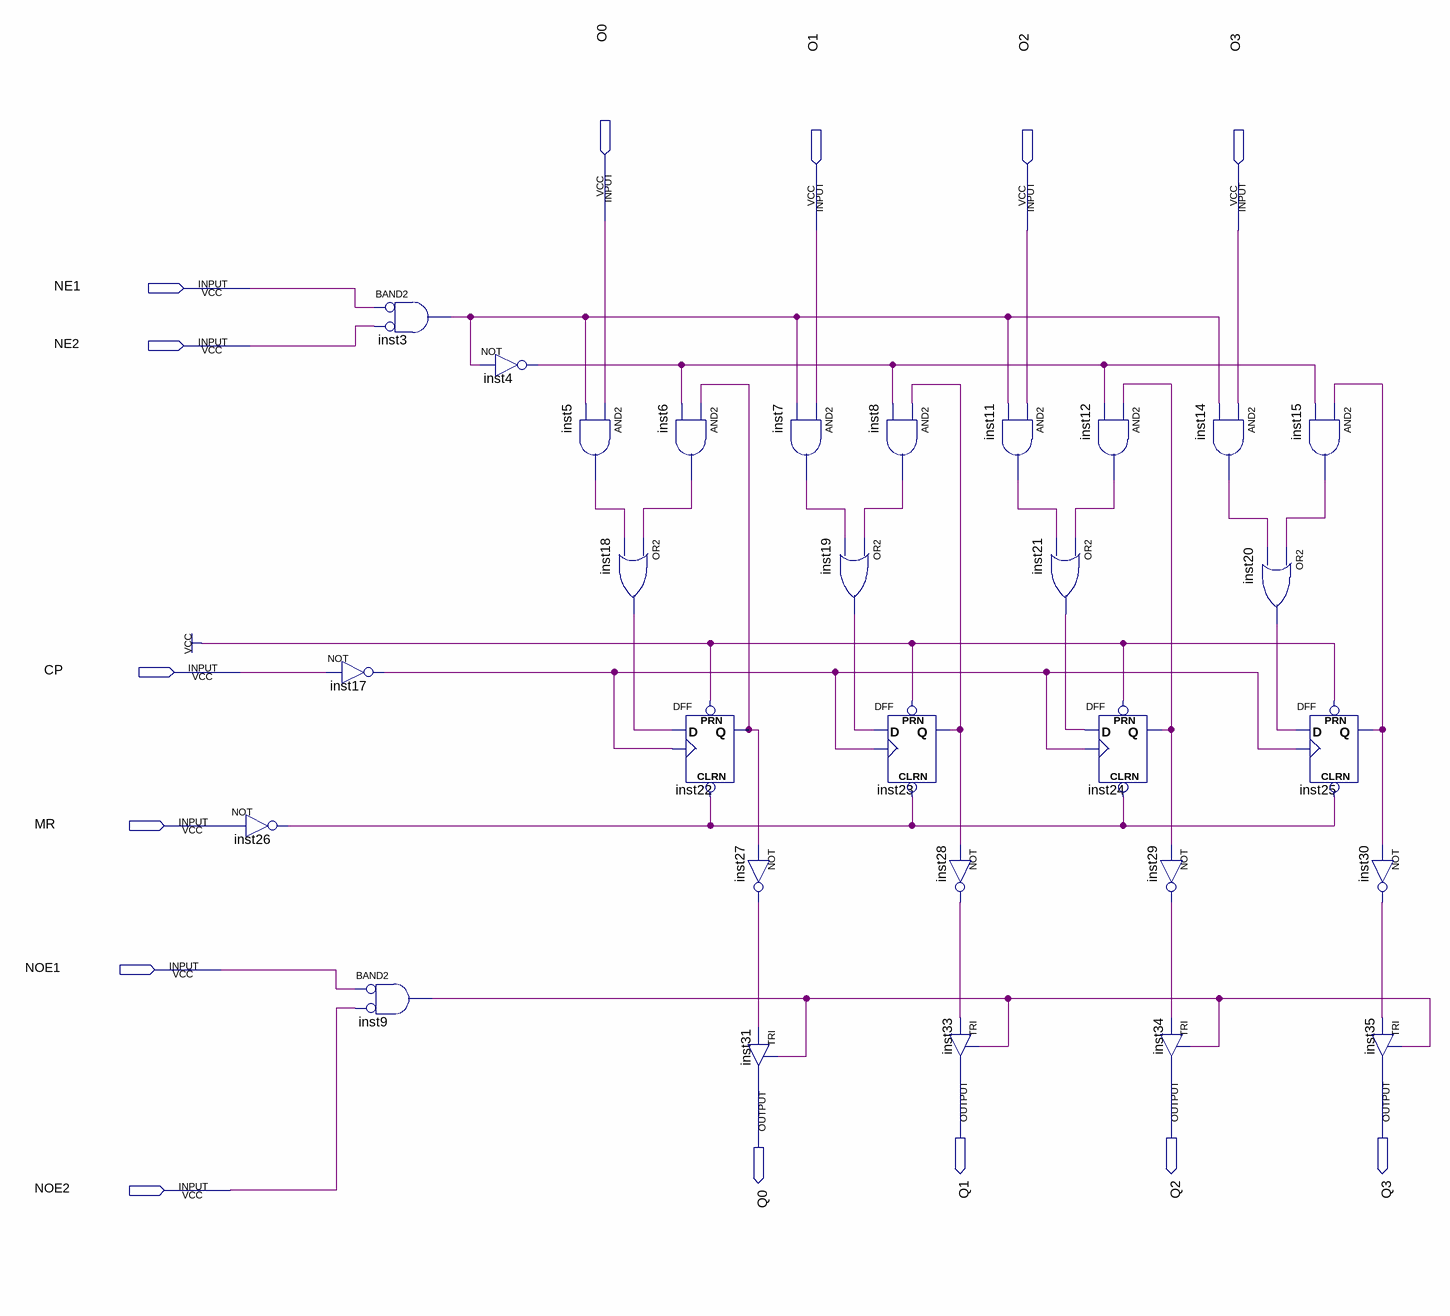
[diagram p0: schematic sheet]
// Quartus schematic CI74173.bdf as structural Verilog: 29 symbols, 14 pins
module CI74173 (
  input  O0,
  input  O1,
  input  O2,
  input  O3,
  input  NE1,
  input  NE2,
  input  CP,
  input  MR,
  input  NOE1,
  input  NOE2,
  output Q1,
  output Q2,
  output Q3,
  output Q0
);

  wire inst3_out, inst4_out, inst5_out, inst6_out, inst7_out, inst8_out, inst9_out, inst11_out, inst12_out,
       inst14_out, inst15_out, inst17_out, inst18_out, inst19_out, inst20_out, inst21_out, inst22_q,
       inst23_q, inst24_q, inst25_q, inst26_out, inst27_out, inst28_out, inst29_out, inst30_out;

  not inst26 (inst26_out, MR);
  not inst17 (inst17_out, CP);
  and inst3 (inst3_out, ~NE1, ~NE2);  // BAND2
  and inst9 (inst9_out, ~NOE1, ~NOE2);  // BAND2
  not inst4 (inst4_out, inst3_out);
  and inst5 (inst5_out, O0, inst3_out);
  or inst18 (inst18_out, inst6_out, inst5_out);
  and inst6 (inst6_out, inst22_q, inst4_out);
  DFF inst22 (.CLRN(inst26_out), .CLK(inst17_out), .D(inst18_out), .PRN(1'b1), .Q(inst22_q));
  and inst7 (inst7_out, O1, inst3_out);
  not inst27 (inst27_out, inst22_q);
  TRI inst31 (.IN(inst27_out), .OE(inst9_out), .OUT(Q0));
  and inst8 (inst8_out, inst23_q, inst4_out);
  or inst19 (inst19_out, inst8_out, inst7_out);
  DFF inst23 (.CLRN(inst26_out), .CLK(inst17_out), .D(inst19_out), .PRN(1'b1), .Q(inst23_q));
  not inst28 (inst28_out, inst23_q);
  TRI inst33 (.IN(inst28_out), .OE(inst9_out), .OUT(Q1));
  and inst11 (inst11_out, O2, inst3_out);
  or inst21 (inst21_out, inst12_out, inst11_out);
  and inst12 (inst12_out, inst24_q, inst4_out);
  DFF inst24 (.CLRN(inst26_out), .CLK(inst17_out), .D(inst21_out), .PRN(1'b1), .Q(inst24_q));
  not inst29 (inst29_out, inst24_q);
  TRI inst34 (.IN(inst29_out), .OE(inst9_out), .OUT(Q2));
  and inst14 (inst14_out, O3, inst3_out);
  or inst20 (inst20_out, inst15_out, inst14_out);
  and inst15 (inst15_out, inst25_q, inst4_out);
  DFF inst25 (.CLRN(inst26_out), .CLK(inst17_out), .D(inst20_out), .PRN(1'b1), .Q(inst25_q));
  not inst30 (inst30_out, inst25_q);
  TRI inst35 (.IN(inst30_out), .OE(inst9_out), .OUT(Q3));
endmodule
